# EAGLE schematic balancebot_1 (EAGLE 9.6.2)
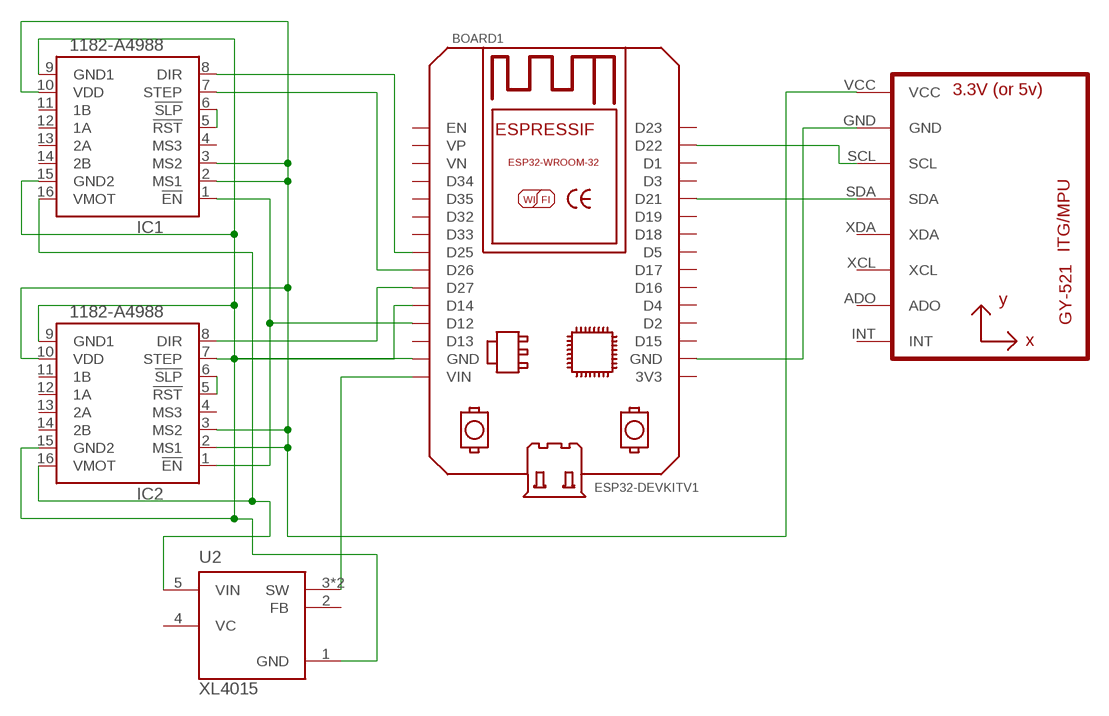
[diagram p0: schematic, sheet 1]

## Parts
BOARD1  ESP32DEVKITV1  [ESP32-DEVKITV1]
IC1  1182-A4988  [A4988]
IC2  1182-A4988  [A4988]
U1  GY-521MPU6050  [GY-521]
U2  XL4015  [CONV_XL4015]

## Nets
N$1: BOARD1.GND IC1.9(GND1) IC1.15(GND2) IC2.9(GND1) IC2.15(GND2) U2.1(GND)
N$2: BOARD1.D12 IC1.1(!EN) IC2.1(!EN)
N$3: BOARD1.D14 IC2.7(STEP)
N$4: IC1.16(VMOT) IC2.16(VMOT) U2.5(VIN)
N$5: BOARD1.D27 IC2.8(DIR)
N$6: BOARD1.D25 IC1.8(DIR)
N$7: BOARD1.D26 IC1.7(STEP)
N$8: IC1.2(MS1) IC1.3(MS2) IC1.10(VDD) IC2.2(MS1) IC2.3(MS2) IC2.10(VDD) U1.VCC
N$9: IC1.5(!RST) IC1.6(!SLP)
N$10: IC2.5(!RST) IC2.6(!SLP)
N$11: BOARD1.VIN U2.3(SW) U2.3.1(SW)
N$12: BOARD1.GND@1(GND) U1.GND
N$13: BOARD1.D22 U1.SCL
N$14: BOARD1.D21 U1.SDA
Unconnected: BOARD1.3V3 BOARD1.D1 BOARD1.D2 BOARD1.D3 BOARD1.D4 BOARD1.D5 BOARD1.D13 BOARD1.D15 BOARD1.D16 BOARD1.D17 BOARD1.D18 BOARD1.D19 BOARD1.D23 BOARD1.D32 BOARD1.D33 BOARD1.D34 BOARD1.D35 BOARD1.EN BOARD1.VN BOARD1.VP IC1.4(MS3) IC1.11(1B) IC1.12(1A) IC1.13(2A) IC1.14(2B) IC2.4(MS3) IC2.11(1B) IC2.12(1A) IC2.13(2A) IC2.14(2B) U1.ADO U1.INT U1.XCL U1.XDA U2.2(FB) U2.4(VC)

## Library data of the parts
BOARD1 = ESP32-DEVKITV1:ESP32DEVKITV1: https://github.com/shridattdudhat
IC1 IC2 = pololu-stepper-driver:1182-A4988: A4988 Stepper Motor Driver Carrier #1182 A4988 Stepper Motor Driver Carrier <https://www.pololu.com/product/1182> in Japan, Suzaku Lab. Ltd. <https://suzakugiken.jp/> #1182 A4988ステッピングモータドライバ <https://szc.jp/po1182>
U1 = gy-521:GY-521
U2 = XL4015:XL4015: 5A 180KHz 36V Buck DC to DC Converter Check availability <https://pricing.snapeda.com/parts/XL4015/XLSEMI/view-part?ref=eda>; AVAILABILITY: Not in stock; CHECK_PRICES: https://www.snapeda.com/parts/XL4015/XLSEMI/view-part/?ref=eda; DESCRIPTION: 5A 180KHz 36V Buck DC to DC Converter; MF: XLSEMI; MP: XL4015; PACKAGE: None; PRICE: None; SNAPEDA_LINK: https://www.snapeda.com/parts/XL4015/XLSEMI/view-part/?ref=snap